# Altium schematic sheet Output.SchDoc
size A4
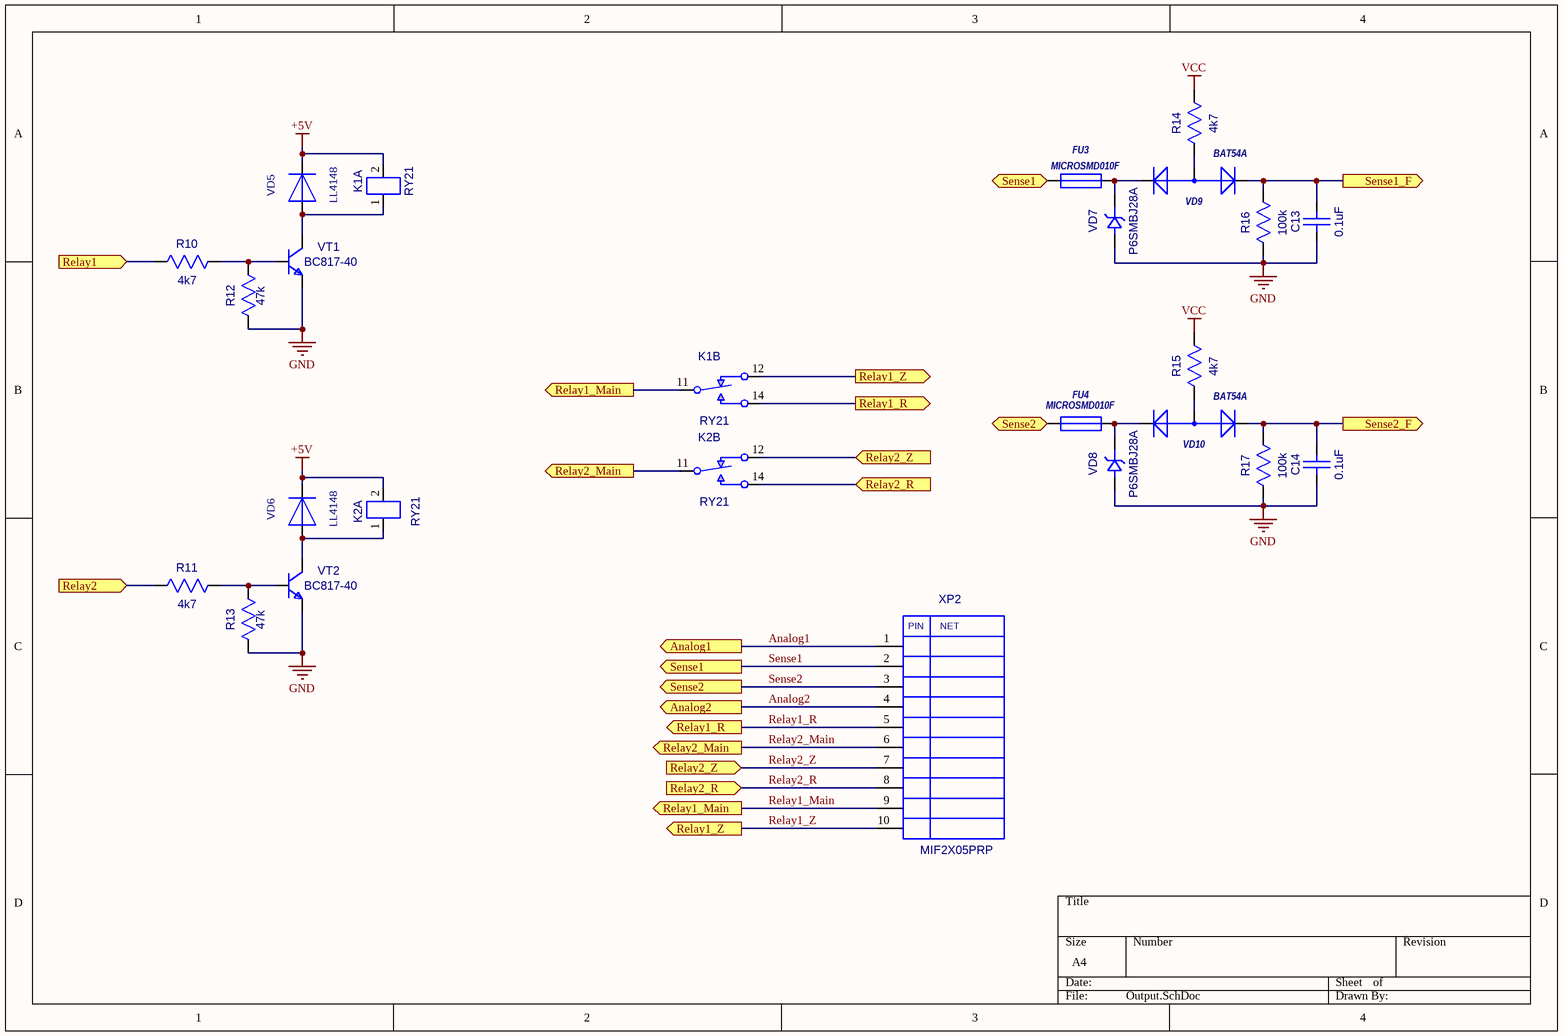
[diagram p0: Output.SchDoc]

## Parts
C13  0.1uF  [CC0603-3M]
C14  0.1uF  [CC0603-3M]
FU3  MICROSMD010F  [RC1210]
FU4  MICROSMD010F  [RC1210]
K1  RY21  [RY21_RY21(Primary)]  (parts A,B of 2)
K2  RY21  [RY21_RY21(Primary)]  (parts A,B of 2)
R10  4k7  [RC0603-3M]
R11  4k7  [RC0603-3M]
R12  47k  [RC0603-3M]
R13  47k  [RC0603-3M]
R14  4k7  [RC0603-3M]
R15  4k7  [RC0603-3M]
R16  100k  [RC0603-3M]
R17  100k  [RC0603-3M]
VD5  LL4148  [SOD-80]
VD6  LL4148  [SOD-80]
VD7  P6SMBJ28A  [SMB]
VD8  P6SMBJ28A  [SMB]
VD9  BAT54A  [SOT-23(123)]
VD10  BAT54A  [SOT-23(123)]
VT1  BC817-40  [SOT-23(123)]
VT2  BC817-40  [SOT-23(123)]
XP2  MIF2X05PRP  [MIF2X05PRP]

## Ports
Analog1 (out), Analog2 (out), Relay1 (in), Relay1_Main (out), Relay1_R (out), Relay1_Z (out), Relay2 (in), Relay2_Main (out), Relay2_R (in), Relay2_Z (in), Sense1 (in), Sense1 (out), Sense1_F (out), Sense2 (in), Sense2 (out), Sense2_F (out)

## Nets
+5V: K1.2(C2) K2.2(C2) VD5.2(+) VD6.2(+)
GND: C13.1(A) C14.1(A) R12.1(A) R13.1(A) R16.1(A) R17.1(A) VD7.1(A) VD8.1(A) VT1.2(E) VT2.2(E)
VCC: R14.2(B) R15.2(B)
Analog1: XP2.1 ; port Analog1
Analog2: XP2.4 ; port Analog2
Relay1: R10.1(A) ; port Relay1
Relay1_Main: K1.11(C1) XP2.9 ; port Relay1_Main
Relay1_R: K1.14(C2) XP2.5 ; port Relay1_R
Relay1_Z: K1.12(C3) XP2.10 ; port Relay1_Z
Relay2: R11.1(A) ; port Relay2
Relay2_Main: K2.11(C1) XP2.6 ; port Relay2_Main
Relay2_R: K2.14(C2) XP2.8 ; port Relay2_R
Relay2_Z: K2.12(C3) XP2.7 ; port Relay2_Z
Sense1: FU3.1 XP2.2 ; port Sense1
Sense1_F: C13.2(B) R16.2(B) VD9.1(K) ; port Sense1_F
Sense2: FU4.1 XP2.3 ; port Sense2
Sense2_F: C14.2(B) R17.2(B) VD10.1(K) ; port Sense2_F
NetFU3_2: FU3.2 VD7.2(K) VD9.2(K)
NetFU4_2: FU4.2 VD8.2(K) VD10.2(K)
NetK1_1: K1.1(L1) VD5.1(-) VT1.3(C)
NetK2_1: K2.1(L1) VD6.1(-) VT2.3(C)
NetR10_2: R10.2(B) R12.2(B) VT1.1(B)
NetR11_2: R11.2(B) R13.2(B) VT2.1(B)
NetR14_1: R14.1(A) VD9.3(A)
NetR15_1: R15.1(A) VD10.3(A)

## Notes on the sheet
- (in symbol MIF2X05PRP) PIN; NET

## Library data of the parts
C13 C14 = CC0603: Value: 0.1uF
FU3 FU4 = MICROSMD: Value: MICROSMD010F
R10-R17 = RC0603
  R10 R11 R14 R15: Value: 4k7
  R12 R13: Value: 47k
  R16 R17: Value: 100k
VD7 VD8 = SMBJ: Value: P6SMBJ28A
VD9 VD10 = BAT54A: 1.0 Ampere General Purpose Rectifier; ComponentField6: Published 8-Jun-2000, Modified 11-July-2000: SIM Model Added.; Value: *
VT1 VT2 = BC846BLT1: Value: {Value}; ComponentField7: Published 29-Sep-2000; OriginalName: BC846BLT1
K1 K2 = RY21: Value: *
VD5 VD6 = LL4148: Value: *
XP2 = MIF2X05PRP: Value: *